# Altium project ArduinoUnoSheild.PrjPcb
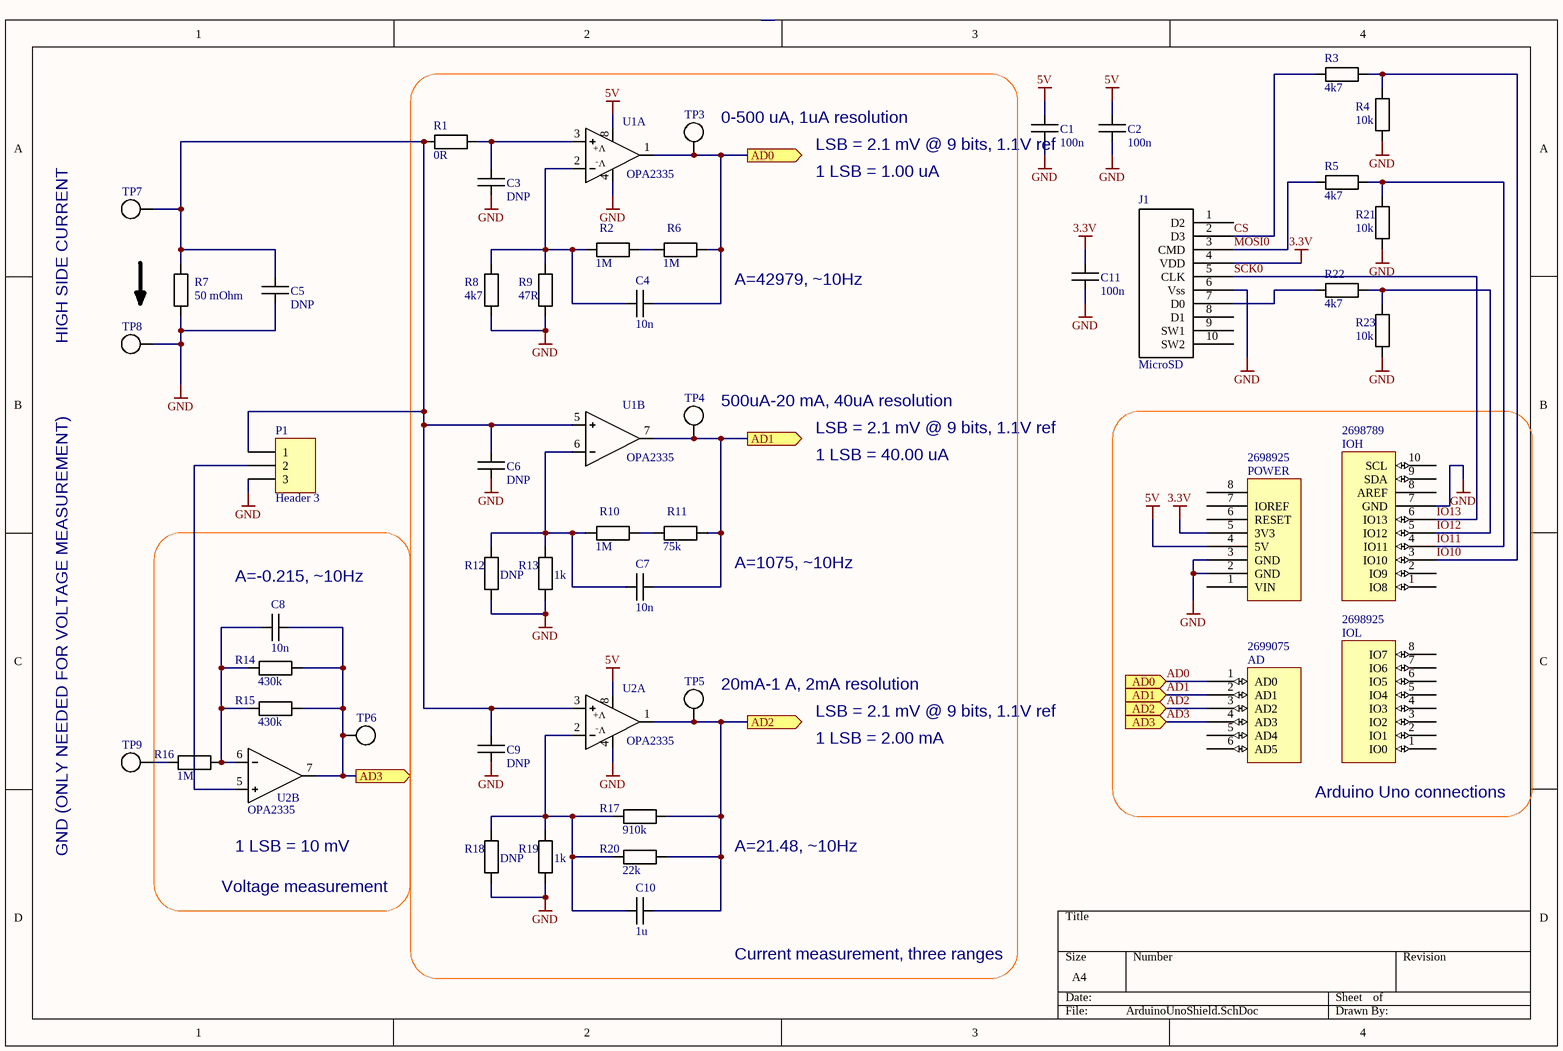
[diagram p0: ArduinoUnoShield.SchDoc]
1 sheet, 49 parts. Net scope: flat (ports and power ports of the same name join across sheets).
Board files: ArduinoUnoShield.PcbDoc, logo.PcbDoc

## Sheet ArduinoUnoShield.SchDoc
size A4

### Parts
AD  Supplier Part Number 4: 2699075  [Header 6x1 8.5mm]  (hidden comment: AD)
C1  value 100n  [0603CAP]  (hidden comment: CAP0603)
C2  value 100n  [0603CAP]  (hidden comment: CAP0603)
C3  value DNP  [0603CAP]  (hidden comment: CAP0603)
C4  value 10n  [0603CAP]  (hidden comment: CAP0603)
C5  value DNP  [0603CAP]  (hidden comment: CAP0603)
C6  value DNP  [0603CAP]  (hidden comment: CAP0603)
C7  value 10n  [0603CAP]  (hidden comment: CAP0603)
C8  value 10n  [0603CAP]  (hidden comment: CAP0603)
C9  value DNP  [0603CAP]  (hidden comment: CAP0603)
C10  value 1u  [0603CAP]  (hidden comment: CAP0603)
C11  value 100n  [0603CAP]  (hidden comment: CAP0603)
IOH  Supplier Part Number 3: 2698789  [Header 10x1 8.5mm]  (hidden comment: IOH)
IOL  Supplier Part Number 4: 2698925  [Header 8x1 8.5mm]  (hidden comment: IOL)
J1  MicroSD  [micro SD]
P1  Header 3  [HDR1X3]
POWER  Supplier Part Number 4: 2698925  [Header 8x1 8.5mm]  (hidden comment: POWER_UNO)
R1  value 0R  [RES0603]  (hidden comment: RES_STANDARD)
R2  value 1M  [RES0603]  (hidden comment: RES_STANDARD)
R3  value 4k7  [RES0603]  (hidden comment: RES_STANDARD)
R4  value 10k  [RES0603]  (hidden comment: RES_STANDARD)
R5  value 4k7  [RES0603]  (hidden comment: RES_STANDARD)
R6  value 1M  [RES0603]  (hidden comment: RES_STANDARD)
R7  value 50 mOhm  [RES0603]  (hidden comment: RES_STANDARD)
R8  value 4k7  [RES0603]  (hidden comment: RES_STANDARD)
R9  value 47R  [RES0603]  (hidden comment: RES_STANDARD)
R10  value 1M  [RES0603]  (hidden comment: RES_STANDARD)
R11  value 75k  [RES0603]  (hidden comment: RES_STANDARD)
R12  value DNP  [RES0603]  (hidden comment: RES_STANDARD)
R13  value 1k  [RES0603]  (hidden comment: RES_STANDARD)
R14  value 430k  [RES0603]  (hidden comment: RES_STANDARD)
R15  value 430k  [RES0603]  (hidden comment: RES_STANDARD)
R16  value 1M  [RES0603]  (hidden comment: RES_STANDARD)
R17  value 910k  [RES0603]  (hidden comment: RES_STANDARD)
R18  value DNP  [RES0603]  (hidden comment: RES_STANDARD)
R19  value 1k  [RES0603]  (hidden comment: RES_STANDARD)
R20  value 22k  [RES0603]  (hidden comment: RES_STANDARD)
R21  value 10k  [RES0603]  (hidden comment: RES_STANDARD)
R22  value 4k7  [RES0603]  (hidden comment: RES_STANDARD)
R23  value 10k  [RES0603]  (hidden comment: RES_STANDARD)
TP3  TESTPOINT_1.6MM  [TESTPOINT_1.6MM]  (value not drawn)
TP4  TESTPOINT_1.6MM  [TESTPOINT_1.6MM]  (value not drawn)
TP5  TESTPOINT_1.6MM  [TESTPOINT_1.6MM]  (value not drawn)
TP6  TESTPOINT_1.6MM  [TESTPOINT_1.6MM]  (value not drawn)
TP7  TESTPOINT_1.6MM  [TESTPOINT_1.6MM]  (value not drawn)
TP8  TESTPOINT_1.6MM  [TESTPOINT_1.6MM]  (value not drawn)
TP9  TESTPOINT_1.6MM  [TESTPOINT_1.6MM]  (value not drawn)
U1  OPA2335  [SO8]  (parts A,B of 2)
U2  OPA2335  [SO8]  (parts A,B of 2)

### Blocks framed on the sheet
Arduino Uno connections: AD IOH IOL POWER

### Ports
AD0 (in), AD0 (out), AD1 (in), AD1 (out), AD2 (in), AD2 (out), AD3 (in), AD3 (out)

### Nets
3.3V: C11.2 J1.4(VDD) POWER.5(3V3)
5V: C1.2 C2.2 POWER.4(5V) U1.8(V+) U2.8(V+)
GND: C1.1 C2.1 C3.2 C5.2 C6.2 C9.2 C11.1 IOH.7(GND) J1.6(Vss) P1.3 POWER.2(GND) POWER.3(GND) R4.1 R7.1 R8.1 R9.1 R12.1 R13.1 R18.1 R19.1 R21.1 R23.1 TP8.1 U1.4(V-) U2.4(V-)
AD0: AD.1(AD0) C4.2 R6.1 TP3.1 U1.1(Output_A) ; port AD0
AD1: AD.2(AD1) C7.2 R11.1 TP4.1 U1.7(OUT_B) ; port AD1
AD2: AD.3(AD2) C10.2 R17.1 R20.1 TP5.1 U2.1(Output_A) ; port AD2
AD3: AD.4(AD3) C8.2 R14.1 R15.1 TP6.1 U2.7(OUT_B) ; port AD3
CS: J1.2(D3) R3.2
IO10: IOH.3(IO10) R3.1 R4.2
IO11: IOH.4(IO11) R5.1 R21.2
IO12: IOH.5(IO12) R22.1 R23.2
IO13: IOH.6(IO13) J1.5(CLK)  [also labelled SCK0]
MOSI0: J1.3(CMD) R5.2
NetC3_1: C3.1 R1.2 U1.3(Non-inv_IN_A)
NetC4_1: C4.1 R2.2 R8.2 R9.2 U1.2(Inv_IN_A)
NetC5_1: C5.1 C6.1 C9.1 P1.1 R1.1 R7.2 TP7.1 U1.5(Non-inv_IN_B) U2.3(Non-inv_IN_A)
NetC7_1: C7.1 R10.2 R12.2 R13.2 U1.6(Inv_IN_B)
NetC8_1: C8.1 R14.2 R15.2 R16.1 U2.6(Inv_IN_B)
NetC10_1: C10.1 R17.2 R18.2 R19.2 R20.2 U2.2(Inv_IN_A)
NetJ1_7: J1.7(D0) R22.2
NetP1_2: P1.2 U2.5(Non-inv_IN_B)
NetR2_1: R2.1 R6.2
NetR10_1: R10.1 R11.2
NetR16_2: R16.2 TP9.1

Not connected (* = marked no-connect by the designer): AD 5(AD4) 6(AD5); IOH 1(IO8) 2(IO9) 8(AREF) 9(SDA) 10(SCL); IOL 1(IO0) 2(IO1) 3(IO2) 4(IO3) 5(IO4) 6(IO5) 7(IO6) 8(IO7); J1 1(D2) 8(D1) 9(SW1) 10(SW2); POWER 1(VIN) 6(RESET) 7(IOREF) 8

### Notes on the sheet
- (near TP3) 0-500 uA, 1uA resolution
- (near C1) LSB = 2.1 mV @ 9 bits, 1.1V ref
- 1 LSB = 1.00 uA
- (near R6) A=42979, ~10Hz
- HIGH SIDE CURRENT
- (near TP4) 500uA-20 mA, 40uA resolution
- LSB = 2.1 mV @ 9 bits, 1.1V ref
- 1 LSB = 40.00 uA
- (near C8) A=-0.215, ~10Hz
- (near R11) A=1075, ~10Hz
- (near TP5) 20mA-1 A, 2mA resolution
- 1 LSB = 2.00 mA
- GND (ONLY NEEDED FOR VOLTAGE MEASUREMENT)
- (near U2) 1 LSB = 10 mV
- A=21.48, ~10Hz
- Voltage measurement
- Current measurement, three ranges

### Library data of the parts
C1-C11 = 185: Ceramic Capacitor SMD 0603; Alternative_Value: True; Geometry_Height: 0.95mm; Sign: Rob; Pin_Count: 2pin; Ref_Prefix: C?; Obsolete: No; Visible: Yes; id: 185; Package: 0603; SMD_TH: SMD; Date_Created: 2010-01-07; Part_Category: Capacitor; Component_Type: Capacitor; RoHS: No; ComponentLink1URL: \\XENABBE\project\CAD\Altium\Library\Datasheet\Capacitor\65C41DD5d01.pdf; ComponentLink1Description: 0603 ceramic capacitor
P1 = Header 3: Header, 3-Pin; LatestRevisionDate: 17-Jul-2002; LatestRevisionNote: Re-released for DXP Platform.; Publisher: Altium Limited
R1-R23 = 276: Resistor 0603 SMD; Geometry_Height: 0.55mm; Sign: Rob; Pin_Count: 2pin; Ref_Prefix: R?; Obsolete: No; Component_Type: Fixed Value; Visible: Yes; id: 276; Package: 0603; SMD_TH: SMD; Date_Created: 2010-01-12; Part_Category: Resistor; RoHS: No
TP3-TP9 = 203: Testpoint; Manufacturer1: Keystone; Part_Number1: 5011; Dist_Part_Number1: 1463078; Part_Category: Connector; Geometry_Height: 8.1mm; Sign: Rik; Pin_Count: 1pin; SMD_TH: TH; Ref_Prefix: X?; Obsolete: No; Visible: Yes; id: 203; Distribuitor1: Farnell; Date_Created: 2010-02-09; Component_Type: Connector; RoHS: Yes; ComponentLink1URL: \\XENABBE\project\CAD\Altium\Library\Datasheet\Connector\Test point 5011 Farnell 1463078-1.pdf; ComponentLink1Description: Testpoint Datasheet
U1 U2 = 104: Dual and Quad 75 MHz GBW Rail-to-Rail I/O Operational; Manufacturer1: Ti; Dist_Part_Number1: 1564752; Part_Category: Amplifier; Geometry_Height: 1.8mm; Sign: Doc; Pin_Count: 8pin; SMD_TH: SMD; Ref_Prefix: U?; Obsolete: No; Component_Type: OP Amplifier; Visible: Yes; id: 104; Distribuitor1: Farnell; Package: SOIC8; Date_Created: 2010-07-01; RoHS: Yes; ComponentLink1URL: \\XENABBE\project\CAD\Altium\Library\Datasheet\Amplifier\LM6152.pdf; ComponentLink1Description: Datasheet in PDF
AD = AD: Supplier 1: Arrow; Supplier Part Number 1: 2699089; Supplier 2: Digi-Key; Supplier Part Number 2: SAM1198-06-ND; Supplier 3: Arrow; Supplier Part Number 3: 2699088; Supplier 4: Arrow
IOH = IOH: Supplier 1: Arrow; Supplier Part Number 1: 2698803S4475693N1004; Supplier 2: Digi-Key; Supplier Part Number 2: SAM1198-10-ND; Supplier 3: Arrow
IOL = IOL: Supplier 1: Digi-Key; Supplier Part Number 1: SAM1198-08-ND; Supplier 2: Arrow; Supplier Part Number 2: 2698939; Supplier 3: Arrow; Supplier Part Number 3: 2698940; Supplier 4: Arrow
POWER = POWER_UNO: Supplier 1: Digi-Key; Supplier Part Number 1: SAM1198-08-ND; Supplier 2: Arrow; Supplier Part Number 2: 2698939; Supplier 3: Arrow; Supplier Part Number 3: 2698940; Supplier 4: Arrow